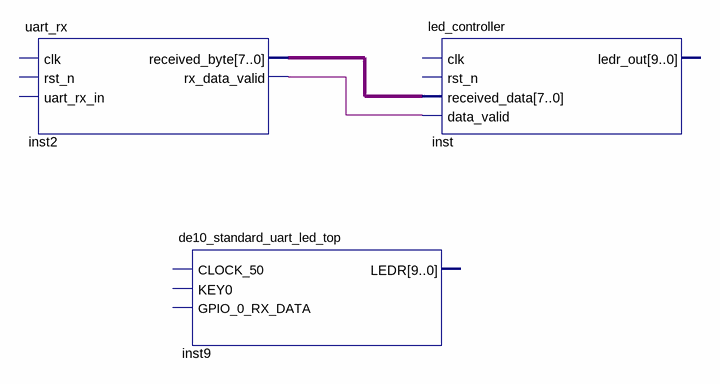
[diagram p0: schematic sheet]
// Quartus schematic GUI_Test.bdf as structural Verilog: 3 symbols, 0 pins
module GUI_Test (
);

  wire inst2_rx_data_valid;
  wire [7:0] inst2_received_byte;

  uart_rx inst2 (
    .received_byte(inst2_received_byte), .rx_data_valid(inst2_rx_data_valid));  // open: clk, rst_n, uart_rx_in
  de10_standard_uart_led_top inst9 ();  // open: CLOCK_50, KEY0, GPIO_0_RX_DATA, LEDR
  led_controller inst (
    .received_data(inst2_received_byte), .data_valid(inst2_rx_data_valid));  // open: clk, rst_n, ledr_out
endmodule
